# Altium schematic sheet main.SchDoc: ELLO TROLL
size A3; Author: KnivD; DrawnBy: KnivD; Engineer: KnivD; DocumentNumber: 1; Revision: 1704; SheetNumber: 1; SheetTotal: 1; ProjectName: ELLO TROLL
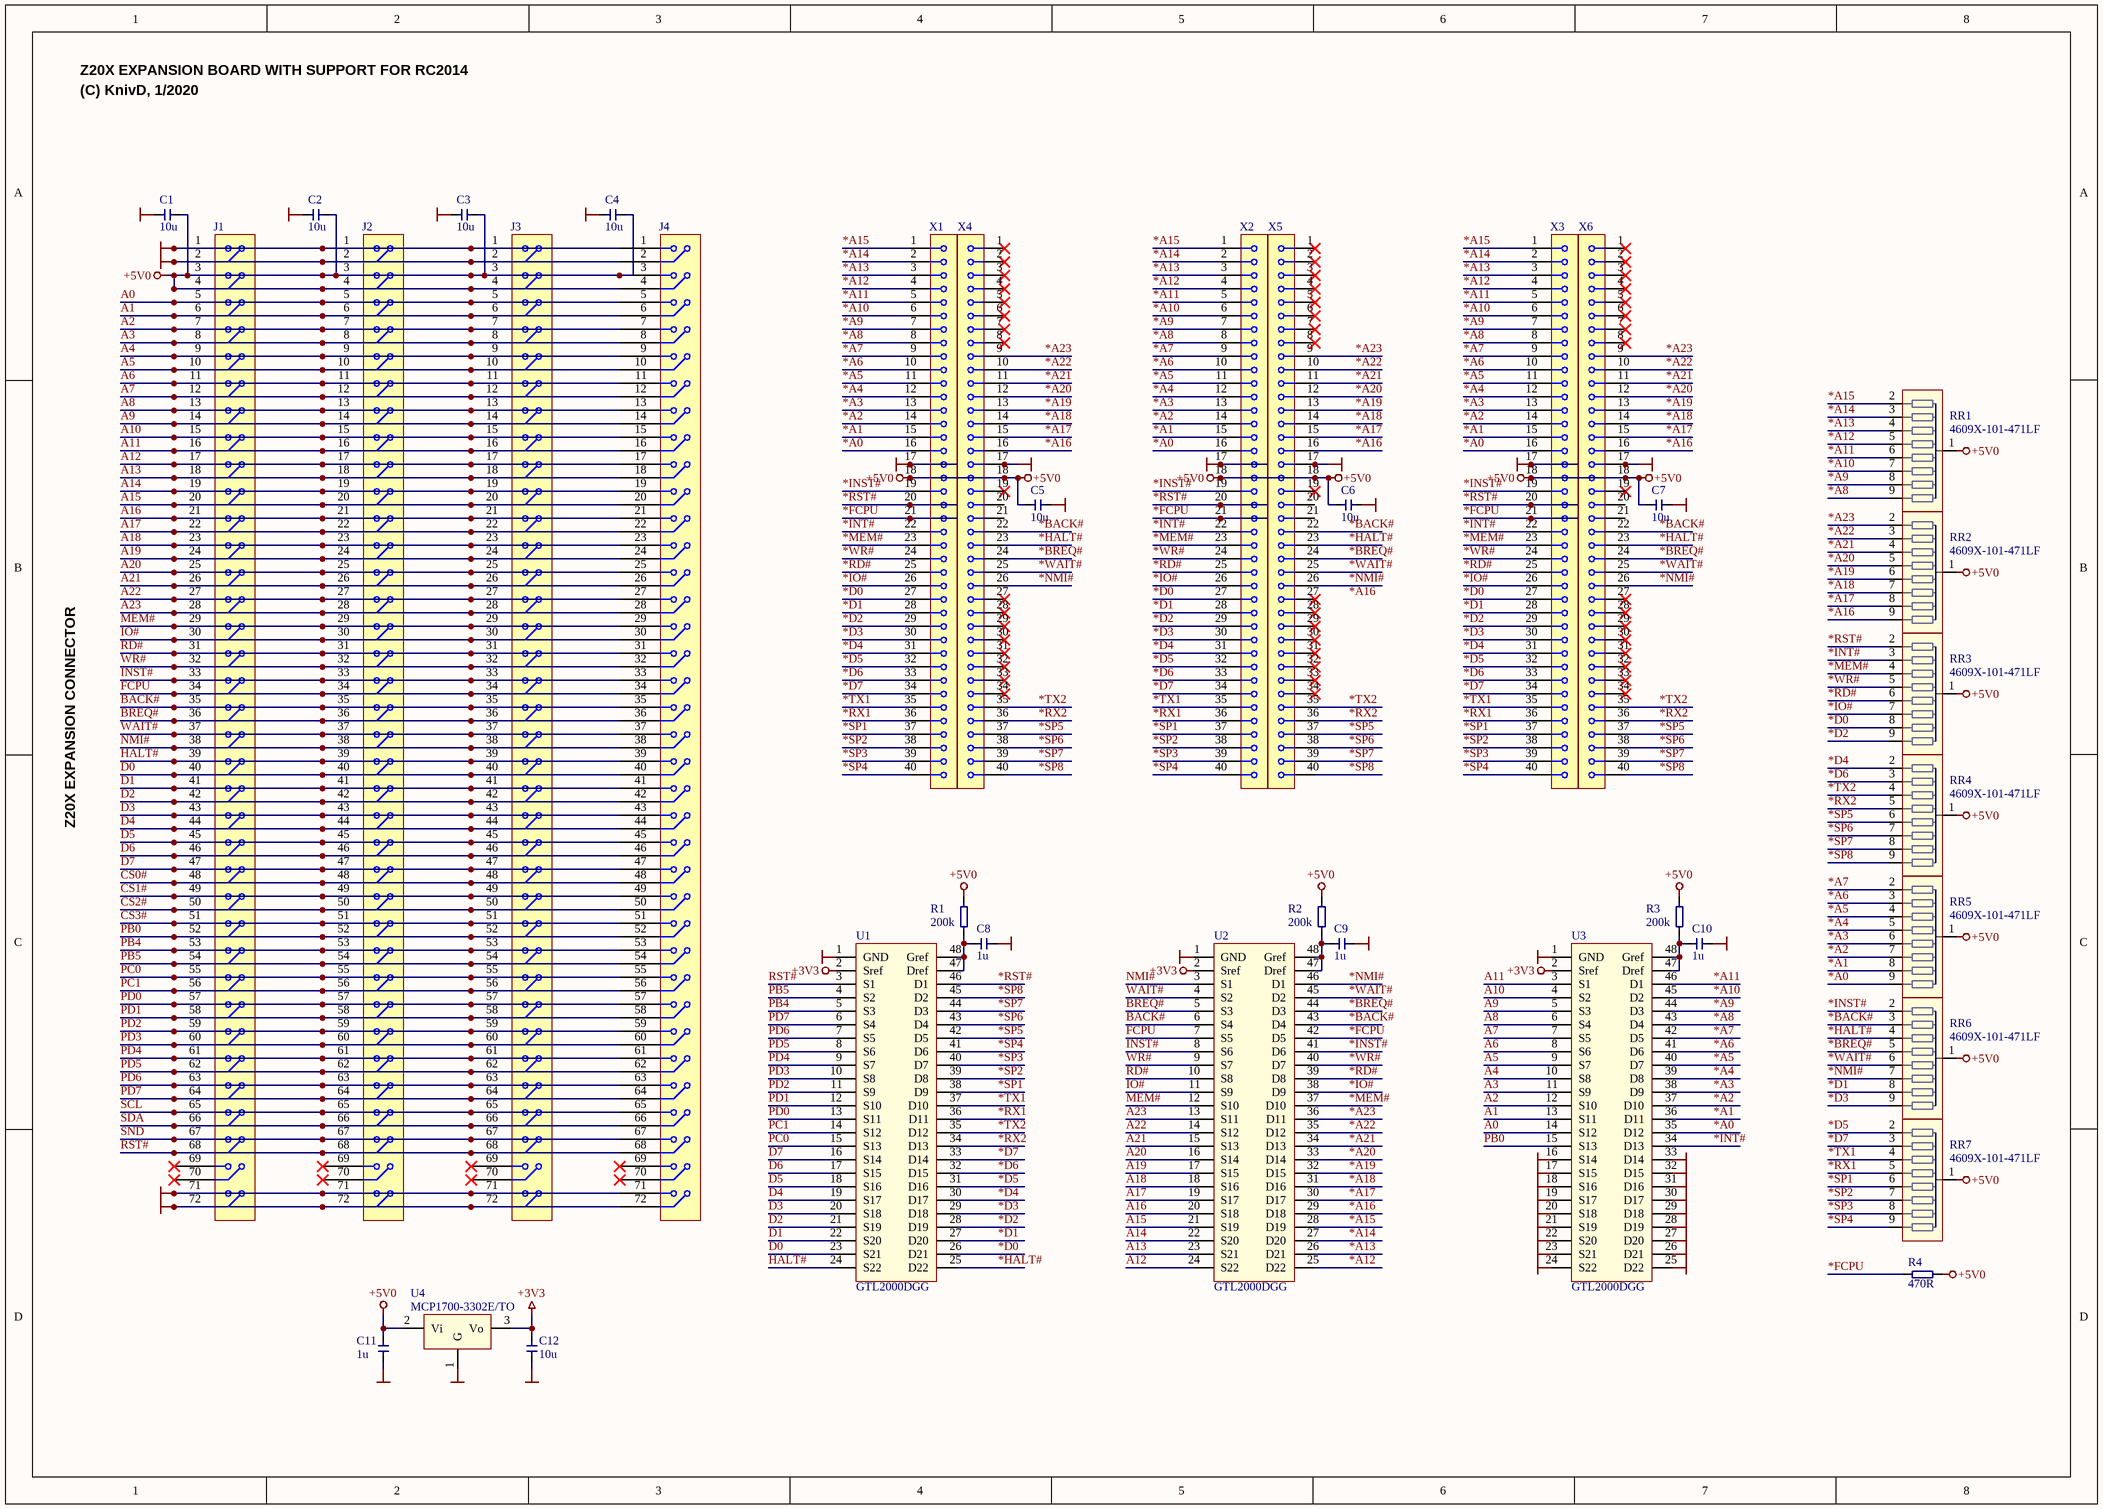
[diagram p0: main.SchDoc]

## Parts
C1  10u  [CAPRR508-350X500X500]
C2  10u  [CAPRR508-350X500X500]
C3  10u  [CAPRR508-350X500X500]
C4  10u  [CAPRR508-350X500X500]
C5  10u  [CAPRR508-350X500X500]
C6  10u  [CAPRR508-350X500X500]
C7  10u  [CAPRR508-350X500X500]
C8  1u  [CAPRR508-350X500X500]
C9  1u  [CAPRR508-350X500X500]
C10  1u  [CAPRR508-350X500X500]
C11  1u  [CAPRR508-350X500X500]
C12  10u  [CAPRR508-350X500X500]
J1  (no value)  [2011-2X36S-F]
J2  (no value)  [2011-2X36S-F]
J3  (no value)  [2011-2X36S-F]
J4  (no value)  [2011-2X36S-F]
R1  200k  [RES1016-660X250]
R2  200k  [RES1016-660X250]
R3  200k  [RES1016-660X250]
R4  470R  [RES1016-660X250]
RR1  4609X-101-471LF  [RN_BOURNS_4600X]
RR2  4609X-101-471LF  [RN_BOURNS_4600X]
RR3  4609X-101-471LF  [RN_BOURNS_4600X]
RR4  4609X-101-471LF  [RN_BOURNS_4600X]
RR5  4609X-101-471LF  [RN_BOURNS_4600X]
RR6  4609X-101-471LF  [RN_BOURNS_4600X]
RR7  4609X-101-471LF  [RN_BOURNS_4600X]
U1  GTL2000DGG  [SOP50P810X120-48N]
U2  GTL2000DGG  [SOP50P810X120-48N]
U3  GTL2000DGG  [SOP50P810X120-48N]
U4  MCP1700-3302E/TO  [TO-92AA-P254]
X1  SIL40-F  [2011-1X40S]  (value not drawn)
X2  SIL40-F  [2011-1X40S]  (value not drawn)
X3  SIL40-F  [2011-1X40S]  (value not drawn)
X4  SIL40-F  [2011-1X40S]  (value not drawn)
X5  SIL40-F  [2011-1X40S]  (value not drawn)
X6  SIL40-F  [2011-1X40S]  (value not drawn)

## Nets
+3V3: C12.1 U1.2(Sref) U2.2(Sref) U3.2(Sref) U4.3(Vo)
+5V0: C1.1 C2.1 C3.1 C4.1 C5.2 C6.2 C7.2 C11.1 J1.3 J1.4 J2.3 J2.4 J3.3 J3.4 J4.3 J4.4 R1.1 R2.1 R3.1 R4.2 RR1.1 RR2.1 RR3.1 RR4.1 RR5.1 RR6.1 RR7.1 U4.2(Vi) X1.18 X2.18 X3.18 X4.18 X5.18 X6.18
GND: C1.2 C2.2 C3.2 C4.2 C5.1 C6.1 C7.1 C8.2 C9.2 C10.2 C11.2 C12.2 J1.1 J1.2 J1.71 J1.72 J2.1 J2.2 J2.71 J2.72 J3.1 J3.2 J3.71 J3.72 J4.1 J4.2 J4.71 J4.72 U1.1(GND) U2.1(GND) U3.1(GND) U3.16(S14) U3.17(S15) U3.18(S16) U3.19(S17) U3.20(S18) U3.21(S19) U3.22(S20) U3.23(S21) U3.24(S22) U3.25(D22) U3.26(D21) U3.27(D20) U3.28(D19) U3.29(D18) U3.30(D17) U3.31(D16) U3.32(D15) U3.33(D14) U4.1(G) X1.17 X2.17 X3.17 X4.17 X5.17 X6.17
*A0: RR5.9 U3.35(D12) X1.16 X2.16 X3.16
*A1: RR5.8 U3.36(D11) X1.15 X2.15 X3.15
*A2: RR5.7 U3.37(D10) X1.14 X2.14 X3.14
*A3: RR5.6 U3.38(D9) X1.13 X2.13 X3.13
*A4: RR5.5 U3.39(D8) X1.12 X2.12 X3.12
*A5: RR5.4 U3.40(D7) X1.11 X2.11 X3.11
*A6: RR5.3 U3.41(D6) X1.10 X2.10 X3.10
*A7: RR5.2 U3.42(D5) X1.9 X2.9 X3.9
*A8: RR1.9 U3.43(D4) X1.8 X2.8 X3.8
*A9: RR1.8 U3.44(D3) X1.7 X2.7 X3.7
*A10: RR1.7 U3.45(D2) X1.6 X2.6 X3.6
*A11: RR1.6 U3.46(D1) X1.5 X2.5 X3.5
*A12: RR1.5 U2.25(D22) X1.4 X2.4 X3.4
*A13: RR1.4 U2.26(D21) X1.3 X2.3 X3.3
*A14: RR1.3 U2.27(D20) X1.2 X2.2 X3.2
*A15: RR1.2 U2.28(D19) X1.1 X2.1 X3.1
*A16: RR2.9 U2.29(D18) X4.16 X5.16 X6.16
*A17: RR2.8 U2.30(D17) X4.15 X5.15 X6.15
*A18: RR2.7 U2.31(D16) X4.14 X5.14 X6.14
*A19: RR2.6 U2.32(D15) X4.13 X5.13 X6.13
*A20: RR2.5 U2.33(D14) X4.12 X5.12 X6.12
*A21: RR2.4 U2.34(D13) X4.11 X5.11 X6.11
*A22: RR2.3 U2.35(D12) X4.10 X5.10 X6.10
*A23: RR2.2 U2.36(D11) X4.9 X5.9 X6.9
*BACK#: RR6.3 U2.43(D4) X4.22 X5.22 X6.22
*BREQ#: RR6.5 U2.44(D3) X4.24 X5.24 X6.24
*D0: RR3.8 U1.26(D21) X1.27 X2.27 X3.27
*D1: RR6.8 U1.27(D20) X1.28 X2.28 X3.28
*D2: RR3.9 U1.28(D19) X1.29 X2.29 X3.29
*D3: RR6.9 U1.29(D18) X1.30 X2.30 X3.30
*D4: RR4.2 U1.30(D17) X1.31 X2.31 X3.31
*D5: RR7.2 U1.31(D16) X1.32 X2.32 X3.32
*D6: RR4.3 U1.32(D15) X1.33 X2.33 X3.33
*D7: RR7.3 U1.33(D14) X1.34 X2.34 X3.34
*FCPU: R4.1 U2.42(D5) X1.21 X2.21 X3.21 X4.21 X5.21 X6.21
*HALT#: RR6.4 U1.25(D22) X4.23 X5.23 X6.23
*INST#: RR6.2 U2.41(D6) X1.19 X2.19 X3.19
*INT#: RR3.3 U3.34(D13) X1.22 X2.22 X3.22
*IO#: RR3.7 U2.38(D9) X1.26 X2.26 X3.26
*MEM#: RR3.4 U2.37(D10) X1.23 X2.23 X3.23
*NMI#: RR6.7 U2.46(D1) X4.26 X5.26 X6.26
*RD#: RR3.6 U2.39(D8) X1.25 X2.25 X3.25
*RST#: RR3.2 U1.46(D1) X1.20 X2.20 X3.20 X4.20 X5.20 X6.20
*RX1: RR7.5 U1.36(D11) X1.36 X2.36 X3.36
*RX2: RR4.5 U1.34(D13) X4.36 X5.36 X6.36
*SP1: RR7.6 U1.38(D9) X1.37 X2.37 X3.37
*SP2: RR7.7 U1.39(D8) X1.38 X2.38 X3.38
*SP3: RR7.8 U1.40(D7) X1.39 X2.39 X3.39
*SP4: RR7.9 U1.41(D6) X1.40 X2.40 X3.40
*SP5: RR4.6 U1.42(D5) X4.37 X5.37 X6.37
*SP6: RR4.7 U1.43(D4) X4.38 X5.38 X6.38
*SP7: RR4.8 U1.44(D3) X4.39 X5.39 X6.39
*SP8: RR4.9 U1.45(D2) X4.40 X5.40 X6.40
*TX1: RR7.4 U1.37(D10) X1.35 X2.35 X3.35
*TX2: RR4.4 U1.35(D12) X4.35 X5.35 X6.35
*WAIT#: RR6.6 U2.45(D2) X4.25 X5.25 X6.25
*WR#: RR3.5 U2.40(D7) X1.24 X2.24 X3.24
A0: J1.5 J2.5 J3.5 J4.5 U3.14(S12)
A1: J1.6 J2.6 J3.6 J4.6 U3.13(S11)
A2: J1.7 J2.7 J3.7 J4.7 U3.12(S10)
A3: J1.8 J2.8 J3.8 J4.8 U3.11(S9)
A4: J1.9 J2.9 J3.9 J4.9 U3.10(S8)
A5: J1.10 J2.10 J3.10 J4.10 U3.9(S7)
A6: J1.11 J2.11 J3.11 J4.11 U3.8(S6)
A7: J1.12 J2.12 J3.12 J4.12 U3.7(S5)
A8: J1.13 J2.13 J3.13 J4.13 U3.6(S4)
A9: J1.14 J2.14 J3.14 J4.14 U3.5(S3)
A10: J1.15 J2.15 J3.15 J4.15 U3.4(S2)
A11: J1.16 J2.16 J3.16 J4.16 U3.3(S1)
A12: J1.17 J2.17 J3.17 J4.17 U2.24(S22)
A13: J1.18 J2.18 J3.18 J4.18 U2.23(S21)
A14: J1.19 J2.19 J3.19 J4.19 U2.22(S20)
A15: J1.20 J2.20 J3.20 J4.20 U2.21(S19)
A16: J1.21 J2.21 J3.21 J4.21 U2.20(S18)
A17: J1.22 J2.22 J3.22 J4.22 U2.19(S17)
A18: J1.23 J2.23 J3.23 J4.23 U2.18(S16)
A19: J1.24 J2.24 J3.24 J4.24 U2.17(S15)
A20: J1.25 J2.25 J3.25 J4.25 U2.16(S14)
A21: J1.26 J2.26 J3.26 J4.26 U2.15(S13)
A22: J1.27 J2.27 J3.27 J4.27 U2.14(S12)
A23: J1.28 J2.28 J3.28 J4.28 U2.13(S11)
BACK#: J1.35 J2.35 J3.35 J4.35 U2.6(S4)
BREQ#: J1.36 J2.36 J3.36 J4.36 U2.5(S3)
CS0#: J1.48 J2.48 J3.48 J4.48
CS1#: J1.49 J2.49 J3.49 J4.49
CS2#: J1.50 J2.50 J3.50 J4.50
CS3#: J1.51 J2.51 J3.51 J4.51
D0: J1.40 J2.40 J3.40 J4.40 U1.23(S21)
D1: J1.41 J2.41 J3.41 J4.41 U1.22(S20)
D2: J1.42 J2.42 J3.42 J4.42 U1.21(S19)
D3: J1.43 J2.43 J3.43 J4.43 U1.20(S18)
D4: J1.44 J2.44 J3.44 J4.44 U1.19(S17)
D5: J1.45 J2.45 J3.45 J4.45 U1.18(S16)
D6: J1.46 J2.46 J3.46 J4.46 U1.17(S15)
D7: J1.47 J2.47 J3.47 J4.47 U1.16(S14)
FCPU: J1.34 J2.34 J3.34 J4.34 U2.7(S5)
HALT#: J1.39 J2.39 J3.39 J4.39 U1.24(S22)
INST#: J1.33 J2.33 J3.33 J4.33 U2.8(S6)
IO#: J1.30 J2.30 J3.30 J4.30 U2.11(S9)
MEM#: J1.29 J2.29 J3.29 J4.29 U2.12(S10)
NMI#: J1.38 J2.38 J3.38 J4.38 U2.3(S1)
PB0: J1.52 J2.52 J3.52 J4.52 U3.15(S13)
PB4: J1.53 J2.53 J3.53 J4.53 U1.5(S3)
PB5: J1.54 J2.54 J3.54 J4.54 U1.4(S2)
PC0: J1.55 J2.55 J3.55 J4.55 U1.15(S13)
PC1: J1.56 J2.56 J3.56 J4.56 U1.14(S12)
PD0: J1.57 J2.57 J3.57 J4.57 U1.13(S11)
PD1: J1.58 J2.58 J3.58 J4.58 U1.12(S10)
PD2: J1.59 J2.59 J3.59 J4.59 U1.11(S9)
PD3: J1.60 J2.60 J3.60 J4.60 U1.10(S8)
PD4: J1.61 J2.61 J3.61 J4.61 U1.9(S7)
PD5: J1.62 J2.62 J3.62 J4.62 U1.8(S6)
PD6: J1.63 J2.63 J3.63 J4.63 U1.7(S5)
PD7: J1.64 J2.64 J3.64 J4.64 U1.6(S4)
RD#: J1.31 J2.31 J3.31 J4.31 U2.10(S8)
RST#: J1.68 J2.68 J3.68 J4.68 U1.3(S1)
SCL: J1.65 J2.65 J3.65 J4.65
SDA: J1.66 J2.66 J3.66 J4.66
SND: J1.67 J2.67 J3.67 J4.67
WAIT#: J1.37 J2.37 J3.37 J4.37 U2.4(S2)
WR#: J1.32 J2.32 J3.32 J4.32 U2.9(S7)
NetC8_1: C8.1 R1.2 U1.47(Dref) U1.48(Gref)
NetC9_1: C9.1 R2.2 U2.47(Dref) U2.48(Gref)
NetC10_1: C10.1 R3.2 U3.47(Dref) U3.48(Gref)

Not connected (* = marked no-connect by the designer): J1 69* 70*; J2 69* 70*; J3 69* 70*; J4 69* 70*; X4 1* 2* 3* 4* 5* 6* 7* 8* 19* 27* 28* 29* 30* 31* 32* 33* 34*; X5 1* 2* 3* 4* 5* 6* 7* 8* 19* 27* 28* 29* 30* 31* 32* 33* 34*; X6 1* 2* 3* 4* 5* 6* 7* 8* 19* 27* 28* 29* 30* 31* 32* 33* 34*

## Notes on the sheet
- Z20X EXPANSION BOARD WITH SUPPORT FOR RC2014
- (C) KnivD, 1/2020
- Z20X EXPANSION CONNECTOR
- Labels drawn without touching a wire or pin: *A16

## Library data of the parts
C1-C12 = Capacitor
J1-J4 = Connector 2x36: Dual row, 72-way connector
R1-R4 = Resistor
RR1-RR7 = Resistor Array x8 (BUSSED): Resistor Array (Bussed)
U1-U3 = GTL2000: 22-bit bi-directional low voltage translator; Manufacturer: NXP
U4 = 78Lxx: 3-terminal 250mA positive voltage regulator; Manufacturer: Microchip
X1-X6 = Connector 1x40: Single row, 40-way connector